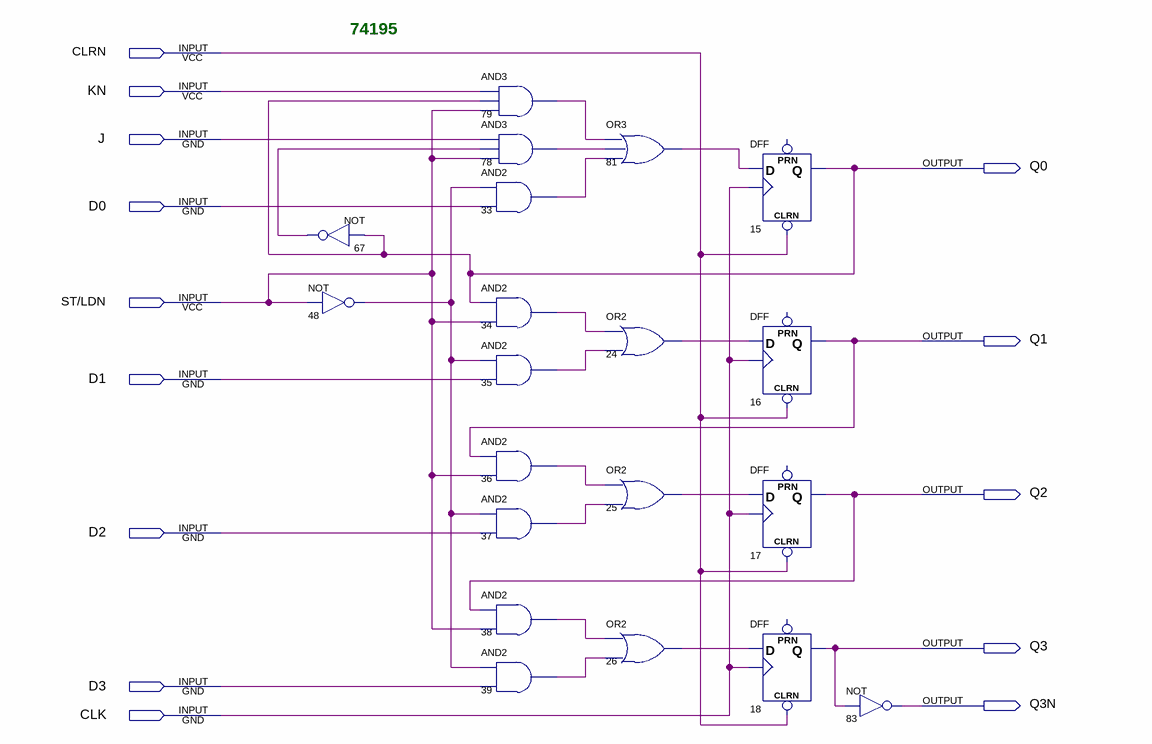
[diagram p0: schematic sheet]
// Quartus schematic 74195.bdf as structural Verilog: 20 symbols, 14 pins
module \74195  (
  input  CLRN,
  input  KN,
  input  J,
  input  D0,
  input  \ST/LDN ,
  input  D1,
  input  D2,
  input  D3,
  input  CLK,
  output Q0,
  output Q1,
  output Q2,
  output Q3,
  output Q3N
);

  wire n24_out, n25_out, n26_out, n33_out, n34_out, n35_out, n36_out, n37_out, n38_out, n39_out, n48_out,
       n67_out, n78_out, n79_out, n81_out;

  not u_67 (n67_out, Q0);
  not u_48 (n48_out, \ST/LDN );
  and u_79 (n79_out, KN, Q0, \ST/LDN );
  and u_78 (n78_out, J, n67_out, \ST/LDN );
  and u_33 (n33_out, n48_out, D0);
  and u_34 (n34_out, Q0, \ST/LDN );
  and u_35 (n35_out, n48_out, D1);
  and u_36 (n36_out, Q1, \ST/LDN );
  and u_37 (n37_out, n48_out, D2);
  and u_38 (n38_out, Q2, \ST/LDN );
  and u_39 (n39_out, n48_out, D3);
  or u_81 (n81_out, n79_out, n78_out, n33_out);
  or u_24 (n24_out, n34_out, n35_out);
  or u_25 (n25_out, n36_out, n37_out);
  or u_26 (n26_out, n38_out, n39_out);
  DFF u_15 (.CLRN(CLRN), .CLK(CLK), .D(n81_out), .Q(Q0));  // open: PRN
  DFF u_16 (.CLRN(CLRN), .CLK(CLK), .D(n24_out), .Q(Q1));  // open: PRN
  DFF u_17 (.CLRN(CLRN), .CLK(CLK), .D(n25_out), .Q(Q2));  // open: PRN
  DFF u_18 (.CLRN(CLRN), .CLK(CLK), .D(n26_out), .Q(Q3));  // open: PRN
  not u_83 (Q3N, Q3);

  // Notes on the sheet:
  //   74195
endmodule
